# EAGLE design balloonSensor (EAGLE 6.1)
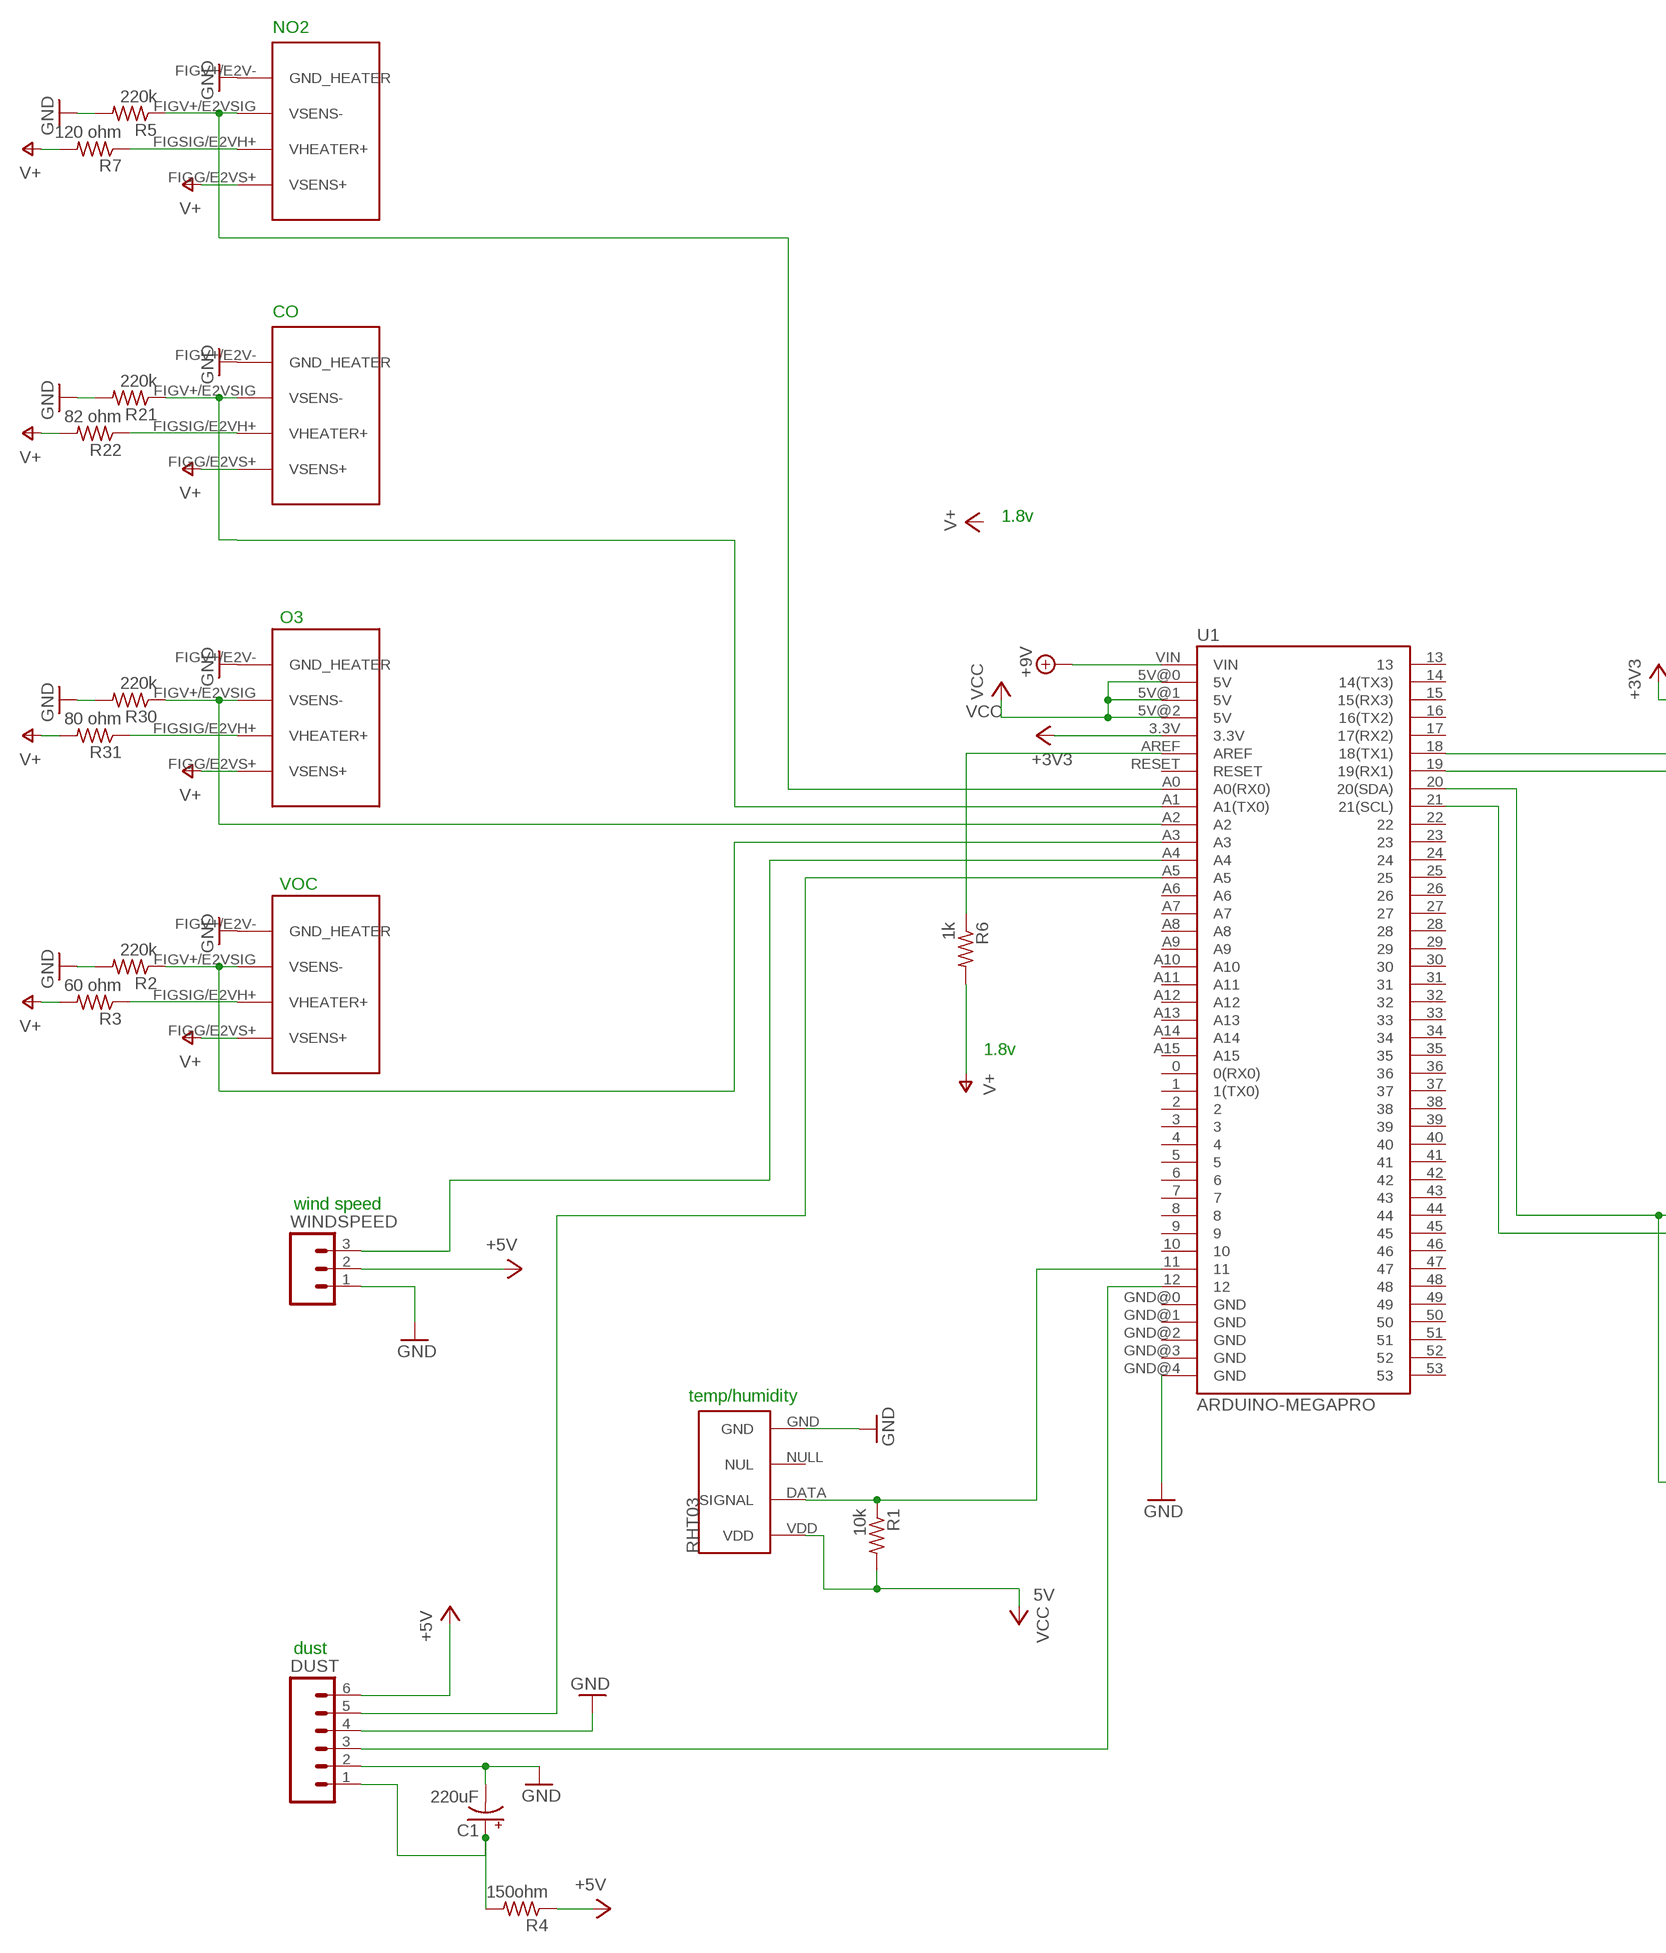
[diagram p0: schematic, sheet 1, part 1 of 2]
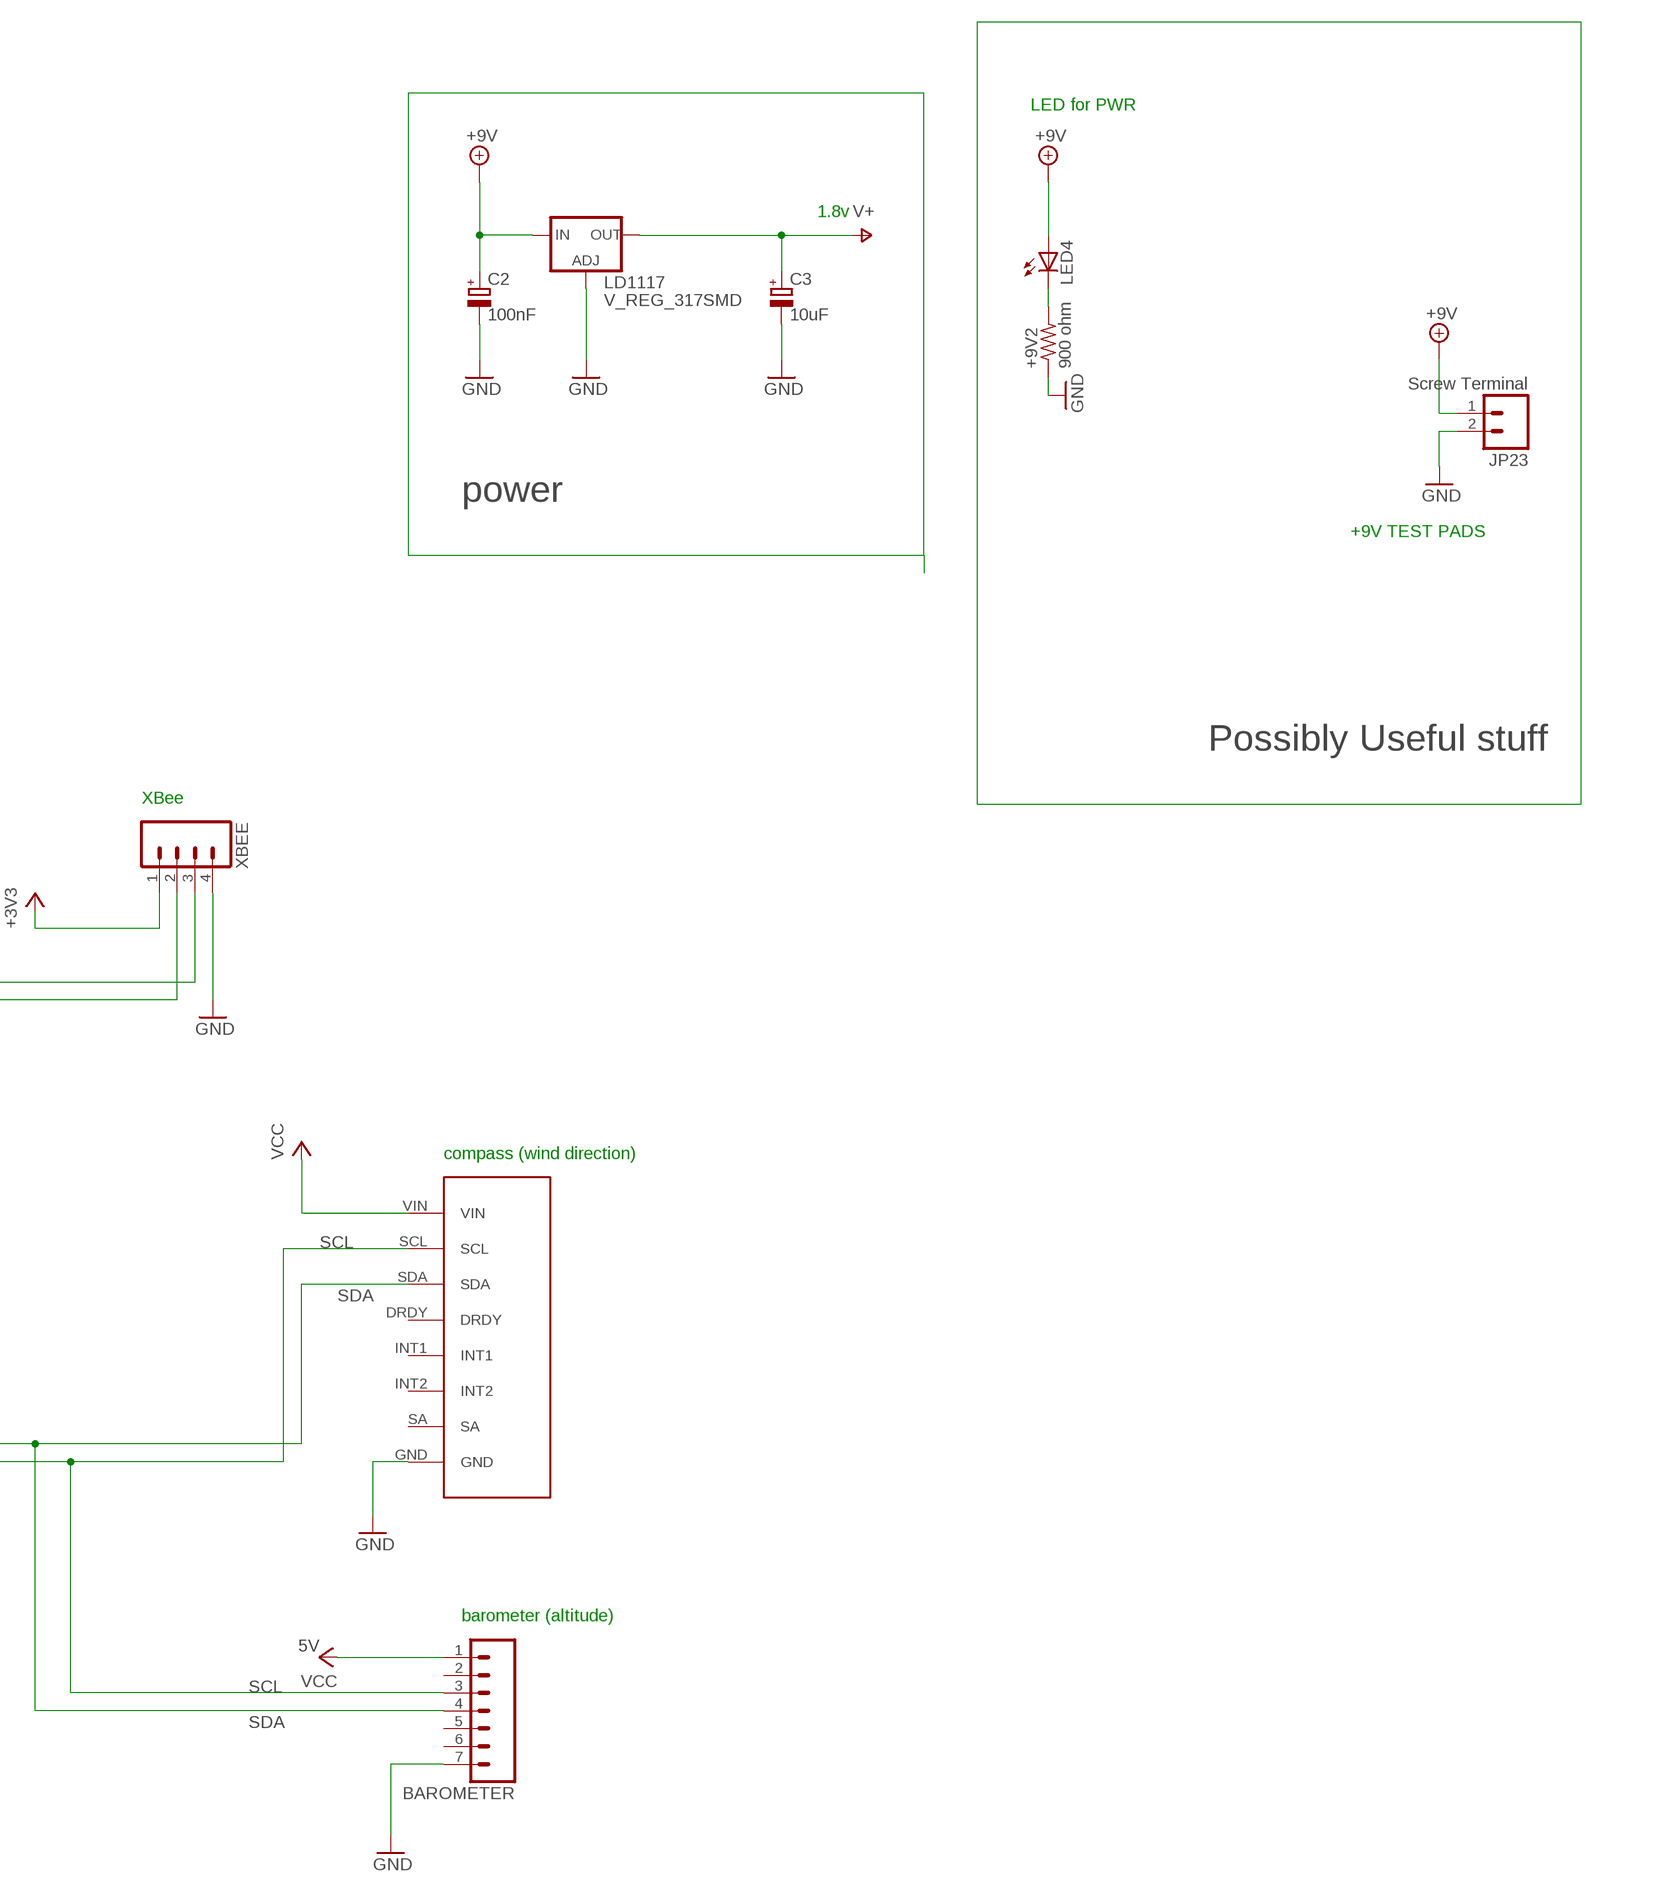
[diagram p1: schematic, sheet 1, part 2 of 2]

## Parts
+9V2  900 ohm  R-US_R1206  [R1206]
BAROMETER  M07LONGPADS  [1X07_LONGPADS]
C1  220uF  CAP_POL7343  [EIA7343]
C2  100nF  CPOL-EUCT3216  [CT3216]
C3  10uF  CPOL-EUCT3216  [CT3216]
CO  E2V  [SR-4]
COMPASS  COMPASS  [COMPASS]
DUST  M06LONGPADS  [1X06_LONGPADS]
JP23  Screw Terminal  M025MM  [SCREWTERMINAL-5MM-2]
LD1117  V_REG_317SMD  [SOT223]
LED4  LED3MM  [LED3MM]
NO2  E2V NO2  E2V  [SR-4]
O3  E2V Ozone  E2V  [SR-4]
R1  10k  R-US_R1206  [R1206]
R2  220k  R-US_R1206  [R1206]
R3  60 ohm  R-US_R1206  [R1206]
R4  150ohm  R-US_R1206  [R1206]
R5  220k  R-US_R1206  [R1206]
R6  1k  R-US_R1206  [R1206]
R7  120 ohm  R-US_R1206  [R1206]
R21  220k  R-US_R1206  [R1206]
R22  82 ohm  R-US_R1206  [R1206]
R30  220k  R-US_R1206  [R1206]
R31  80 ohm  R-US_R1206  [R1206]
TEMP/HUMIDITY  RHT03  [1X04_LOCK]
U1  ARDUINO-MEGAPRO  [ARDUINO_MEGA-PRO-3.3V]
VOC  E2V Ozone  E2V  [SR-4]
WINDSPEED  M03LONGPADS  [1X03_LONGPADS]
XBEE  M04LONGPADS  [1X04_LONGPADS]

## Nets
3: R1.1 TEMP/HUMIDITY.DATA(SIGNAL) U1.11
5V: R1.2 TEMP/HUMIDITY.VDD ; supply symbol labelled VCC
+3V3: U1.3.3V XBEE.1
+5V: DUST.6 R4.1 WINDSPEED.2
+9V: C2.+ JP23.1 LD1117.3(IN) LED4.A U1.VIN
GND: +9V2.1 BAROMETER.7 C1.C(-) C2.- C3.- CO.FIGV+/E2V-(GND_HEATER) COMPASS.GND DUST.2 DUST.4 JP23.2 LD1117.1(ADJ) NO2.FIGV+/E2V-(GND_HEATER) O3.FIGV+/E2V-(GND_HEATER) R2.2 R5.2 R21.2 R30.2 TEMP/HUMIDITY.GND U1.GND@4(GND) VOC.FIGV+/E2V-(GND_HEATER) WINDSPEED.1 XBEE.4
N$1: R3.1 VOC.FIGSIG/E2VH+(VHEATER+)
N$2: R2.1 U1.A3 VOC.FIGV+/E2VSIG(VSENS-)
N$4: R6.1 U1.AREF
N$5: U1.19(19(RX1)) XBEE.2
N$7: U1.A4 WINDSPEED.3
N$8: C1.A(+) DUST.1 R4.2
N$10: DUST.3 U1.12
N$11: DUST.5 U1.A5
N$13: U1.18(18(TX1)) XBEE.3
N$24: +9V2.2 LED4.K(C)
N$38: CO.FIGSIG/E2VH+(VHEATER+) R22.1
N$43: NO2.FIGSIG/E2VH+(VHEATER+) R7.1
N$45: O3.FIGSIG/E2VH+(VHEATER+) R31.1
N$47: CO.FIGV+/E2VSIG(VSENS-) R21.1 U1.A1(A1(TX0))
N$50: NO2.FIGV+/E2VSIG(VSENS-) R5.1 U1.A0(A0(RX0))
N$55: O3.FIGV+/E2VSIG(VSENS-) R30.1 U1.A2
SCL: BAROMETER.3 COMPASS.SCL U1.21(21(SCL))
SDA: BAROMETER.4 COMPASS.SDA U1.20(20(SDA))
V+: C3.+ CO.FIGG/E2VS+(VSENS+) LD1117.2(OUT) NO2.FIGG/E2VS+(VSENS+) O3.FIGG/E2VS+(VSENS+) R3.2 R6.2 R7.2 R22.2 R31.2 VOC.FIGG/E2VS+(VSENS+)
VCC: BAROMETER.1 COMPASS.VIN U1.5V@0(5V) U1.5V@1(5V) U1.5V@2(5V)
Unconnected: BAROMETER.2 BAROMETER.5 BAROMETER.6 COMPASS.DRDY COMPASS.INT1 COMPASS.INT2 COMPASS.SA TEMP/HUMIDITY.NULL(NUL) U1.0(0(RX0)) U1.1(1(TX0)) U1.2 U1.3 U1.4 U1.5 U1.6 U1.7 U1.8 U1.9 U1.10 U1.13 U1.14(14(TX3)) U1.15(15(RX3)) U1.16(16(TX2)) U1.17(17(RX2)) U1.22 U1.23 U1.24 U1.25 U1.26 U1.27 U1.28 U1.29 U1.30 U1.31 U1.32 U1.33 U1.34 U1.35 U1.36 U1.37 U1.38 U1.39 U1.40 U1.41 U1.42 U1.43 U1.44 U1.45 U1.46 U1.47 U1.48 U1.49 U1.50 U1.51 U1.52 U1.53 U1.A6 U1.A7 U1.A8 U1.A9 U1.A10 U1.A11 U1.A12 U1.A13 U1.A14 U1.A15 U1.GND@0(GND) U1.GND@1(GND) U1.GND@2(GND) U1.GND@3(GND) U1.RESET

## Notes on the sheet
- LED for PWR
- 1.8v
- NO2
- power
- +9V TEST PADS
- CO
- 1.8v | Possibly Useful stuff
- XBee
- O3
- VOC
- compass (wind direction)
- 1.8v
- wind speed
- barometer (altitude)
- temp/humidity
- dust

## Library data of the parts
+9V2 R1-R7 R21 R22 R30 R31 = rcl:R-US_: RESISTOR, American symbol
BAROMETER = SparkFun:M07: Header 7 Standard 7-pin 0.1" header. Use with straight break away headers (SKU : PRT-00116), right angle break away headers (PRT-00553), swiss pins (PRT-00743), machine pins (PRT-00117), and female headers (PRT-00115). NOTES ON THE VARIANTS LOCK and LOCK_LONGPADS... This footprint was designed to help hold the alignment of a through-hole component (i.e. 7-pin header) while soldering it into place. You may notice that each hole has been shifted either up or down by 0.005 of an inch from it's more standard position (which is usually a perfectly straight line). This slight alteration caused the pins (the squares in the middle) to touch the edges of the holes. Because they are alternating, it causes a "brace" to hold the header in place. 0.005 has proven to be the perfect amount of "off-center" position when using our standard breakaway headers. Although looks a little odd when you look at the bare footprint, once you have a header in there, the alteration is very hard to notice. Also, if you push a header all the way into place, it is covered up entirely on the bottom side. This idea of altering the position of holes to aid alignment will be further integrated into the Sparkfun Library for other footprints. It can help hold any component with 3 or more connection pins.
C1 = SparkFun:CAP_POL: Capacitor Polarized These are standard SMD and PTH capacitors. Normally 10uF, 47uF, and 100uF in electrolytic and tantalum varieties. Always verify the external diameter of the through hole cap, it varies with capacity, voltage, and manufacturer. The EIA devices should be standard.
C2 C3 = resistor:CPOL-EU: POLARIZED CAPACITOR, European symbol
CO NO2 O3 VOC = ricardo:E2V
COMPASS = balloonshield:COMPASS
DUST = SparkFun:M06: Header 6 Standard 6-pin 0.1" header. Use with straight break away headers (SKU : PRT-00116), right angle break away headers (PRT-00553), swiss pins (PRT-00743), machine pins (PRT-00117), and female headers (PRT-00115). Molex polarized connector foot print use with SKU : PRT-08094 with associated crimp pins and housings. NOTES ON THE VARIANTS LOCK and LOCK_LONGPADS... This footprint was designed to help hold the alignment of a through-hole component (i.e. 6-pin header) while soldering it into place. You may notice that each hole has been shifted either up or down by 0.005 of an inch from it's more standard position (which is a perfectly straight line). This slight alteration caused the pins (the squares in the middle) to touch the edges of the holes. Because they are alternating, it causes a "brace" to hold the component in place. 0.005 has proven to be the perfect amount of "off-center" position when using our standard breakaway headers. Although looks a little odd when you look at the bare footprint, once you have a header in there, the alteration is very hard to notice. Also, if you push a header all the way into place, it is covered up entirely on the bottom side. This idea of altering the position of holes to aid alignment will be further integrated into the Sparkfun Library for other footprints. It can help hold any component with 3 or more connection pins.
JP23 = SparkFun:M02: Header 2 Standard 2-pin 0.1" header. Use with straight break away headers (SKU : PRT-00116), right angle break away headers (PRT-00553), swiss pins (PRT-00743), machine pins (PRT-00117), and female headers (PRT-00115). Molex polarized connector foot print use with SKU : PRT-08233 with associated crimp pins and housings.
LD1117 = SparkFun:V_REG_317: Voltage Regulator Standard LM317 adjustable voltage regulator. AOI (Adjust Output Input). Google 'LM317 Calculator' for easy to use app to get the two resistor values needed. 240/720 for 5V output. 240/390 for 3.3V output. Spark Fun Electronics SKU : COM-00527
LED4 = SparkFun:LED: LEDs Standard schematic elements and footprints for 5mm, 3mm, 1206, and 0603 sized LEDs. 5mm - Spark Fun Electronics SKU : COM-00529 (and others)
TEMP/HUMIDITY = ricardo:RHT03
U1 = SparkFun:ARDUINO-MEGA: Arduino Mega footprint connections
WINDSPEED = SparkFun:M03: Header 3 Standard 3-pin 0.1" header. Use with straight break away headers (SKU : PRT-00116), right angle break away headers (PRT-00553), swiss pins (PRT-00743), machine pins (PRT-00117), and female headers (PRT-00115). Molex polarized connector foot print use with SKU : PRT-08232 with associated crimp pins and housings.
XBEE = SparkFun:M04: Header 4 Standard 4-pin 0.1" header. Use with straight break away headers (SKU : PRT-00116), right angle break away headers (PRT-00553), swiss pins (PRT-00743), machine pins (PRT-00117), and female headers (PRT-00115). Molex polarized connector foot print use with SKU : PRT-08231 with associated crimp pins and housings. 1MM SMD Version SKU: PRT-10208

## Board
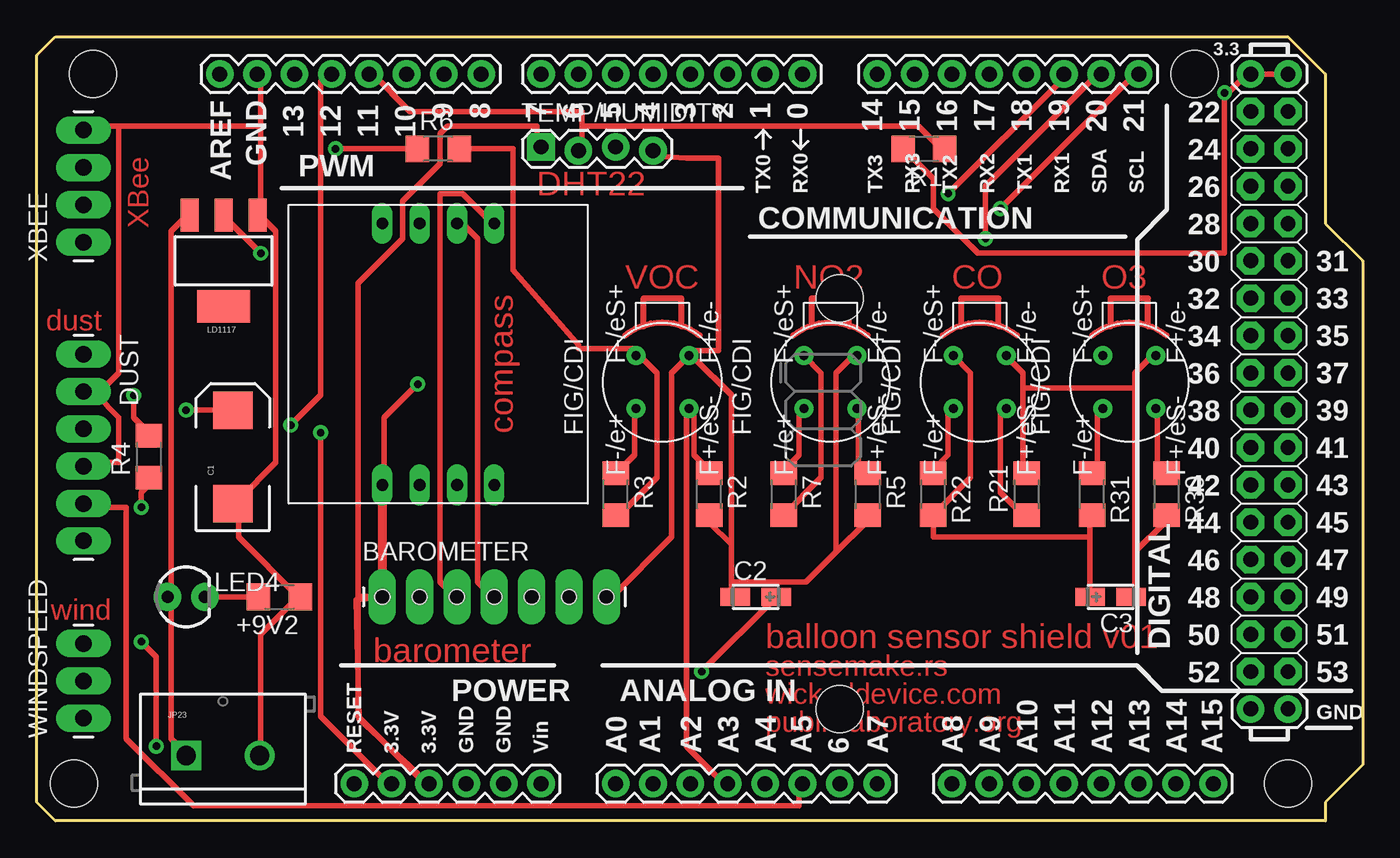
[diagram p2: board, top side]
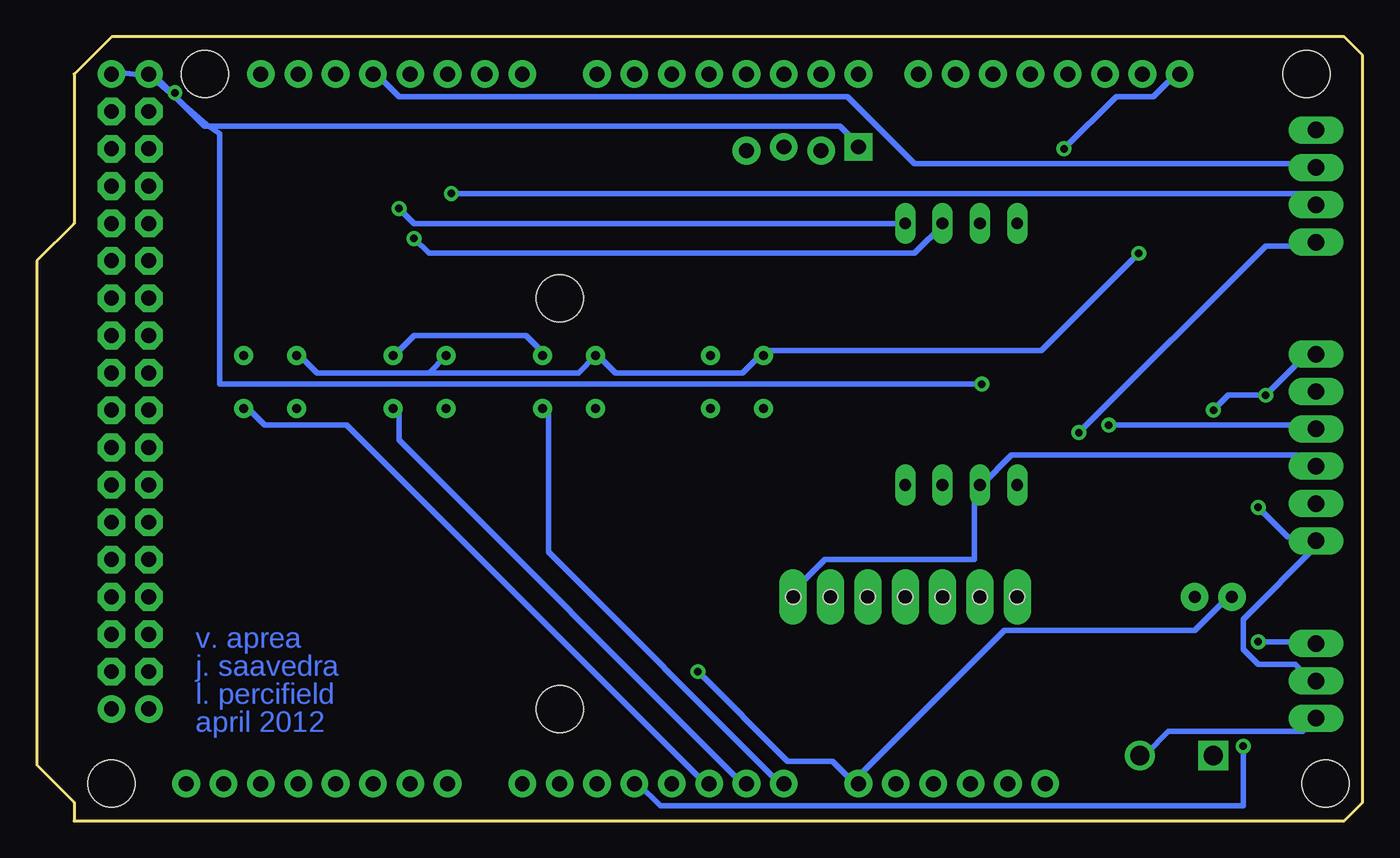
[diagram p3: board, bottom side, seen from below]

Size 90.17 x 53.34 mm. Coordinates in mm from the lower left corner, seen from the top.
Copper layers (1*16): Top 0.035mm / dielectric 1.5mm / Bottom 0.035mm
Design rules: minimum track width 15mil, minimum drill 20mil, track to track 8mil, track to pad 8mil, pad to pad 8mil, via to via 8mil, smd to smd 8mil, copper to edge 10mil, drill to drill 8mil, minimum pad ring 12mil, minimum via ring 10mil, stop-mask expansion 4mil, vias tented up to drill 25mil, thermal gap 10mil

### Footprints (pad centres in the part's own frame; a part is rotated, then mirrored left to right if it is on the bottom)
R1206 = smd 1.6 x 1.803: 1 -1.422,0; 2 1.422,0
1X07_LONGPADS = drill 1.016 pad 1.88 long: 1 0,0; 2 2.54,0; 3 5.08,0; 4 7.62,0; 5 10.16,0; 6 12.7,0; 7 15.24,0 | hole 1.016: 0,0; 2.54,0; 5.08,0; 7.62,0; 10.16,0; 12.7,0; 15.24,0
EIA7343 = smd 2.55 x 2.7: A 3.17,0; C -3.17,0
CT3216 = smd 2 x 1.2: + 1.4,0; - -1.4,0
SR-4 = drill 0.62 pad 1.3: FIGG/E2VS+ 1.8,1.8; FIGSIG/E2VH+ -1.8,1.8; FIGV+/E2V- 1.8,-1.8; FIGV+/E2VSIG -1.8,-1.8
COMPASS = drill 0.8 long: DRDY -8.89,-1.27; GND 8.89,-1.27; INT1 8.89,3.81; INT2 8.89,1.27; SA -8.89,-3.81; SCL -8.89,3.81; SDA -8.89,1.27; VIN 8.89,-3.81
1X06_LONGPADS = drill 1.118 pad 1.88 long: 1 0,0; 2 2.54,0; 3 5.08,0; 4 7.62,0; 5 10.16,0; 6 12.7,0
SCREWTERMINAL-5MM-2 = drill 1.3 pad 2.032 square: 1 0,0 | drill 1.3 pad 2.032: 2 5,0
SOT223 = smd 1.219 x 2.235: 1 -2.311,-3.099; 2 0,-3.099; 3 2.311,-3.099 | smd 3.6 x 2.2: 4 0,3.099
LED3MM = drill 0.813 pad 1.88: A -1.27,0; K 1.27,0
1X04_LOCK = drill 1.016 pad 1.88: DATA 2.54,-0.127; GND 7.62,-0.127; NULL 5.08,0.127 | drill 1.016 pad 1.88 square: VDD 0,0.127
ARDUINO_MEGA-PRO-3.3V = drill 1.016 pad 1.88: 0 52.07,50.8; 1 49.53,50.8; 2 46.99,50.8; 3 44.45,50.8; 3.3V 24.13,2.54; 4 41.91,50.8; 5 39.37,50.8; 5V@0 26.67,2.54; 5V@1 82.55,50.8; 5V@2 85.09,50.8; 6 36.83,50.8; 7 34.29,50.8; 8 30.226,50.8; 9 27.686,50.8; 10 25.146,50.8; 11 22.606,50.8; 12 20.066,50.8; 13 17.526,50.8; 14 57.15,50.8; 15 59.69,50.8; 16 62.23,50.8; 17 64.77,50.8; 18 67.31,50.8; 19 69.85,50.8; 20 72.39,50.8; 21 74.93,50.8; A0 39.37,2.54; A1 41.91,2.54; A2 44.45,2.54; A3 46.99,2.54; A4 49.53,2.54; A5 52.07,2.54; A6 54.61,2.54; A7 57.15,2.54; A8 62.23,2.54; A9 64.77,2.54; A10 67.31,2.54; A11 69.85,2.54; A12 72.39,2.54; A13 74.93,2.54; A14 77.47,2.54; A15 80.01,2.54; AREF 12.446,50.8; GND@0 29.21,2.54; GND@1 31.75,2.54; GND@2 82.55,7.62; GND@3 85.09,7.62; GND@4 14.986,50.8; RESET 21.59,2.54; VIN 34.29,2.54 | drill 1.016 pad 1.88 octagon: 22 82.55,48.26; 23 85.09,48.26; 24 82.55,45.72; 25 85.09,45.72; 26 82.55,43.18; 27 85.09,43.18; 28 82.55,40.64; 29 85.09,40.64; 30 82.55,38.1; 31 85.09,38.1; 32 82.55,35.56; 33 85.09,35.56; 34 82.55,33.02; 35 85.09,33.02; 36 82.55,30.48; 37 85.09,30.48; 38 82.55,27.94; 39 85.09,27.94; 40 82.55,25.4; 41 85.09,25.4; 42 82.55,22.86; 43 85.09,22.86; 44 82.55,20.32; 45 85.09,20.32; 46 82.55,17.78; 47 85.09,17.78; 48 82.55,15.24; 49 85.09,15.24; 50 82.55,12.7; 51 85.09,12.7; 52 82.55,10.16; 53 85.09,10.16 | hole 3.2: 3.81,50.8; 2.54,2.54; 54.61,35.56; 54.61,7.62; 78.74,50.8; 85.09,2.54
1X03_LONGPADS = drill 1.118 pad 1.88 long: 1 0,0; 2 2.54,0; 3 5.08,0
1X04_LONGPADS = drill 1.118 pad 1.88 long: 1 0,0; 2 2.54,0; 3 5.08,0; 4 7.62,0

### Placement (x,y rotation side)
+9V2  16.51,15.24 180 top
BAROMETER  23.5,15.24 0 top
C1  13.34,24.77 90 top
C2  48.89,15.24 0 top
C3  73.03,15.24 180 top
CO  64.14,29.84 90 top
COMPASS  27.3,31.75 270 top
DUST  3.18,31.75 270 top
JP23  10.16,4.45 0 top
LD1117  12.7,38.1 180 top
LED4  10.16,15.24 0 top
NO2  53.97,29.84 90 top
O3  74.3,29.84 90 top
R1  60.32,45.72 180 top
R2  45.72,22.23 270 top
R3  39.37,22.23 270 top
R4  7.62,24.77 90 top
R5  56.51,22.23 270 top
R6  27.3,45.72 0 top
R7  50.8,22.23 270 top
R21  67.31,22.23 90 top
R22  60.96,22.23 270 top
R30  76.84,22.23 270 top
R31  71.76,22.23 270 top
TEMP/HUMIDITY  34.29,45.72 0 top
U1  0,0 0 top
VOC  42.54,29.84 90 top
WINDSPEED  3.18,6.99 90 top
XBEE  3.18,39.37 90 top

### Tracks (layer width: path | path; a pad name or v marks a point on that pad's centre or on a via)
3
  Top 0.381: 37.08,47.24 59.94,47.24 61.47,45.72 R1.1 | 37.08,47.24 37.08,45.72 TEMP/HUMIDITY.DATA | 37.08,47.24 37.08,48.26 25.4,48.26 22.86,50.8 U1.11
5V  (via drill 0.51)
  Top 0.381: 82.3,50.8 80.9,49.4 | 80.9,49.4 80.77,49.28 80.77,38.61 64.01,38.61 60.96,41.66 60.96,43.69 58.93,45.72 R1.2 | 26.42,2.54 21.84,7.11 21.84,36.58 24.89,39.62 24.89,42.16 27.43,44.7 27.43,46.74 27.94,47.24 34.04,47.24 34.04,46.23 TEMP/HUMIDITY.VDD | v80.77,49.53 80.9,49.4
  Bottom 0.381: 80.9,49.4 78.74,47.24 35.56,47.24 34.54,46.23 TEMP/HUMIDITY.VDD | 80.9,49.4 82.3,50.8 | v80.77,49.53 80.9,49.4
+3V3  (via drill 0.51)
  Top 0.381: v19.3,26.42 19.3,7.11 23.88,2.54 U1.3.3V
  Bottom 0.381: v19.3,26.42 6.6,39.12 3.56,39.12 XBEE.1
+5V  (via drill 0.51)
  Top 0.381: v7.11,21.34 7.11,22.35 7.62,22.86 R4.1
  Bottom 0.381: v7.11,21.34 5.08,19.3 3.56,19.3 DUST.6 3.05,18.8 8.13,13.72 8.13,11.68 7.11,10.67 4.57,10.67 3.56,9.65 WINDSPEED.2
+9V  (via drill 0.51)
  Top 0.381: v45.21,10.16 C2.+ | 9.14,15.24 9.14,40.13 10.16,41.15 LD1117.3 | 9.14,15.24 9.14,5.59 10.16,4.57 JP23.1 | 9.14,15.24 LED4.A
  Bottom 0.381: v45.21,10.16 39.12,4.06 36.07,4.06 34.54,2.54 U1.VIN 34.29,3.05 24.38,12.95 11.43,12.95 9.14,15.24 LED4.A
GND
  Top 0.381: 17.78,15.24 13.72,19.3 13.72,21.34 C1.C 13.72,21.84 16.26,24.38 16.26,40.13 15.24,41.15 LD1117.1 15.24,41.66 15.24,47.24 | 17.78,15.24 15.24,12.7 15.24,4.57 JP23.2 | 17.78,15.24 +9V2.1 | 4.06,28.96 3.56,29.46 DUST.2 4.06,28.96 | 4.06,28.96 5.59,27.43 5.59,24.38 3.56,24.38 DUST.4 | 15.24,47.24 15.24,50.8 U1.GND@4 | 15.24,47.24 5.59,47.24 | 5.59,47.24 3.56,47.24 XBEE.4 | 4.06,28.96 5.59,30.48 5.59,47.24 | 67.06,29.46 67.06,30.48 66.04,31.5 CO.FIGV+/E2V- | 67.06,29.46 67.06,23.88 R21.2 | 74.68,18.29 76.71,20.32 R30.2 | 74.68,18.29 74.68,15.24 C3.- | 74.68,18.29 74.68,29.46 | 74.68,29.46 74.68,30.48 75.69,31.5 O3.FIGV+/E2V- | 74.68,29.46 67.06,29.46 | 47.24,18.8 45.72,20.32 R2.2 | 47.24,16.26 47.24,15.24 C2.- | 47.24,16.26 47.24,18.8 | 54.36,18.29 52.32,16.26 47.24,16.26 | 54.36,18.29 56.39,20.32 R5.2 | 47.24,18.8 47.24,28.96 44.7,31.5 VOC.FIGV+/E2V- | 54.36,18.29 54.36,30.48 55.37,31.5 NO2.FIGV+/E2V- | TEMP/HUMIDITY.GND 42.16,45.21 44.2,45.09 46.35,45.09 46.35,32 44.2,32 VOC.FIGV+/E2V- | VOC.FIGV+/E2V- 43.18,30.48 43.18,19.3 39.12,15.24 BAROMETER.7
  Bottom 0.381: WINDSPEED.1 4.06,6.1 13.21,6.1 14.73,4.57 JP23.2 | BAROMETER.7 39.12,15.24 36.58,17.78 26.42,17.78 26.42,22.86 COMPASS.GND 25.91,22.86 23.88,24.89 4.06,24.89 3.56,24.38 DUST.4 | CO.FIGV+/E2V- 65.53,32 64.52,33.02 56.9,33.02 55.88,32 NO2.FIGV+/E2V-
N$1
  Top 0.381: R3.1 39.62,23.88 40.64,24.89 40.64,27.94 VOC.FIGSIG/E2VH+
N$2
  Top 0.381: R2.1 45.72,23.88 44.7,24.89 44.7,27.94 VOC.FIGV+/E2VSIG 44.2,27.94 44.2,5.08 46.74,2.54 U1.A3
N$3
  Top 0.406: 40,33.02 arc-77 45.08,33.02 | 51.43,33.02 arc-77 56.51,33.02 | 61.59,33.02 arc-77 66.67,33.02 | 71.76,33.02 arc-77 76.84,33.02
N$4  (via drill 0.51)
  Top 0.381: v20.32,45.72 R6.1
  Bottom 0.381: v20.32,45.72 16.76,49.28 14.22,49.28 12.7,50.8 U1.AREF
N$5  (via drill 0.51)
  Top 0.381: v61.98,42.67 69.6,50.29 69.6,50.8 U1.19
  Bottom 0.381: v61.98,42.67 4.06,42.67 3.56,42.16 XBEE.2
N$6
  Top 0.406: 41.27,33.66 41.27,35.56 43.81,35.56 43.81,33.66 | 52.7,33.66 52.7,35.56 55.24,35.56 55.24,33.66 | 62.87,33.66 62.87,35.56 65.41,35.56 65.41,33.66 | 73.03,33.66 73.03,35.56 75.56,35.56 75.56,33.66
N$7  (via drill 0.51)
  Top 0.381: v7.11,12.19 8.13,11.18 v8.13,5.08
  Bottom 0.381: v7.11,12.19 3.56,12.19 WINDSPEED.3 | v8.13,5.08 8.13,1.02 47.75,1.02 49.28,2.54 U1.A4
N$8  (via drill 0.51)
  Top 0.381: v6.6,28.96 6.6,27.43 7.62,26.42 R4.2 | v10.16,27.94 13.21,27.94 C1.A
  Bottom 0.381: DUST.1 3.56,31.5 4.06,31.5 v6.6,28.96 9.14,28.96 v10.16,27.94
N$10  (via drill 0.51)
  Top 0.381: v17.27,26.92 19.3,28.96 19.3,50.29 19.81,50.8 U1.12
  Bottom 0.381: v17.27,26.92 3.56,26.92 DUST.3
N$11
  Top 0.381: DUST.5 3.56,21.34 6.1,21.34 6.1,5.59 10.67,1.02 51.82,1.02 51.82,2.54 U1.A5
N$13
  Bottom 0.381: XBEE.3 3.56,44.7 30.48,44.7 35.05,49.28 65.53,49.28 67.06,50.8 U1.18
N$24
  Top 0.381: LED4.K +9V2.2
N$38
  Top 0.381: R22.1 60.96,23.88 61.98,24.89 61.98,27.94 CO.FIGSIG/E2VH+
N$43
  Top 0.381: R7.1 50.8,23.88 51.82,24.89 51.82,27.94 NO2.FIGSIG/E2VH+
N$45
  Top 0.381: R31.1 72.14,23.88 72.14,27.94 O3.FIGSIG/E2VH+
N$47
  Top 0.381: R21.1 67.06,20.83 65.53,22.35 65.53,27.94 CO.FIGV+/E2VSIG
  Bottom 0.381: U1.A1 42.16,2.54 65.53,25.91 65.53,27.94 CO.FIGV+/E2VSIG
N$50
  Top 0.381: R5.1 56.39,23.88 55.88,24.38 55.88,27.94 NO2.FIGV+/E2VSIG
  Bottom 0.381: U1.A0 39.62,2.54 55.37,18.29 55.37,27.94 NO2.FIGV+/E2VSIG
N$55
  Top 0.381: R30.1 76.71,23.88 76.2,24.38 76.2,27.94 O3.FIGV+/E2VSIG
  Bottom 0.381: U1.A2 44.7,2.54 69.09,26.92 74.68,26.92 75.69,27.94 O3.FIGV+/E2VSIG
SCL  (via drill 0.51)
  Top 0.381: COMPASS.SCL 30.99,40.64 28.96,42.67 27.43,42.67 27.43,16.26 28.45,15.24 BAROMETER.3 | v65.53,41.66 74.68,50.8 U1.21
  Bottom 0.381: v65.53,41.66 64.52,40.64 COMPASS.SCL
SDA  (via drill 0.51)
  Top 0.381: COMPASS.SDA 28.96,40.64 29.97,39.62 29.97,16.26 30.99,15.24 BAROMETER.4 | v64.52,39.62 64.52,43.18 72.14,50.8 U1.20
  Bottom 0.381: v64.52,39.62 63.5,38.61 30.48,38.61 28.45,40.64 COMPASS.SDA
V+  (via drill 0.51)
  Top 0.381: NO2.FIGG/E2VS+ 53.34,30.48 53.34,23.37 50.8,20.83 R7.2 | 71.63,19.3 C3.+ | 71.63,19.3 71.63,20.32 R31.2 | CO.FIGG/E2VS+ 63.5,30.48 63.5,23.37 60.96,20.83 R22.2 60.96,19.3 71.63,19.3 | R3.2 39.62,20.83 42.16,23.37 42.16,30.48 41.15,31.5 VOC.FIGG/E2VS+ 40.64,32 40.64,32.13 36.83,32.13 36.83,32.38 32.38,37.47 32.38,45.72 R6.2 | v15.24,38.61 12.7,41.15 LD1117.2
  Bottom 0.381: 63.5,30.48 71.12,30.48 72.14,31.5 O3.FIGG/E2VS+ | CO.FIGG/E2VS+ 63.5,30.48 | 63.5,30.48 53.34,30.48 NO2.FIGG/E2VS+ 51.82,31.5 50.8,30.48 42.16,30.48 41.15,31.5 VOC.FIGG/E2VS+ 40.64,32 21.84,32 v15.24,38.61
VCC  (via drill 0.51)
  Top 0.381: 23.37,15.24 23.37,22.86 COMPASS.VIN 23.62,22.86 | U1.5V@1 U1.5V@2 | U1.5V@0 21.91,6.92 21.72,15.05 23.62,15.24 | v25.91,29.72 23.62,27.43 23.62,22.86 | 23.62,22.86 23.62,15.24 | 23.62,15.24 BAROMETER.1
  Top 0.406: BAROMETER.1 21.91,15.24
  Bottom 0.381: v25.91,29.72 77.72,29.72 77.72,46.74 78.61,47.37 82.42,50.67 84.71,50.93 U1.5V@2

### Text on the board
Top: DHT22 | XBee | VOC | NO2 | CO | O3 | dust | compass | wind | balloon sensor shield v01 | barometer | sensemake.rs | wickeddevice.com | publiclaboratory.org
Bottom: v. aprea | j. saavedra | l. percifield | april 2012